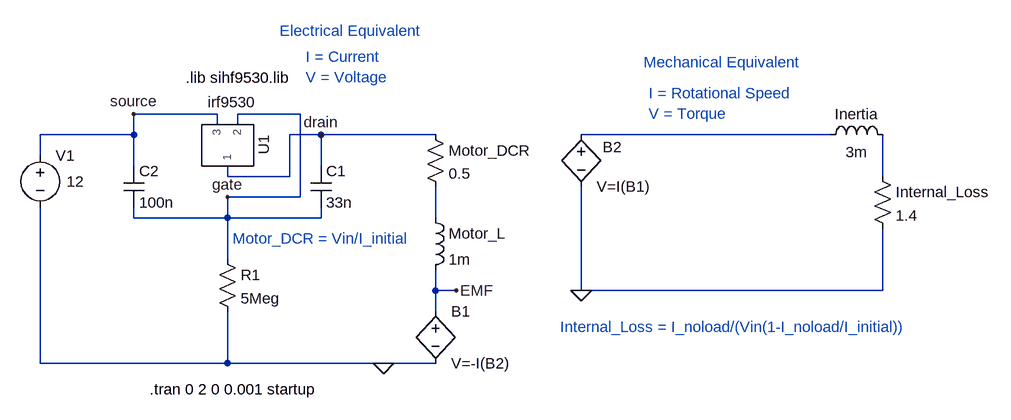
[diagram p0: schematic Motor sim YES softstart.asc]
Motor sim YES softstart.asc, the LTspice schematic file:
Version 4
SHEET 1 1992 680
WIRE -80 0 -208 0
WIRE 48 0 -48 0
WIRE -80 16 -80 0
WIRE -48 16 -48 0
WIRE -208 32 -208 0
WIRE -208 32 -352 32
WIRE 80 32 32 32
WIRE 256 32 80 32
WIRE 864 32 480 32
WIRE -352 64 -352 32
WIRE -208 80 -208 32
WIRE 80 80 80 32
WIRE -64 96 -64 80
WIRE 32 96 32 32
WIRE 32 96 -64 96
WIRE 944 96 944 32
WIRE 48 128 48 0
WIRE 48 128 -64 128
WIRE -208 160 -208 144
WIRE -64 160 -64 128
WIRE -64 160 -208 160
WIRE 80 160 80 144
WIRE 80 160 -64 160
WIRE 256 160 256 112
WIRE -64 224 -64 160
WIRE 256 272 256 240
WIRE 288 272 256 272
WIRE 480 272 480 112
WIRE 944 272 944 176
WIRE 944 272 480 272
WIRE 256 304 256 272
WIRE -352 384 -352 144
WIRE -64 384 -64 304
WIRE -64 384 -352 384
WIRE 176 384 -64 384
WIRE 256 384 176 384
FLAG 288 272 EMF
FLAG 480 272 0
FLAG 176 384 0
FLAG -64 128 gate
FLAG 80 32 drain
FLAG -208 0 source
SYMBOL voltage -352 48 R0
WINDOW 3 41 56 Left 2
WINDOW 123 0 0 Left 0
WINDOW 39 0 0 Left 0
SYMATTR Value 12
SYMATTR InstName V1
SYMBOL res 240 16 R0
SYMATTR InstName Motor_DCR
SYMATTR Value 0.5
SYMBOL res 928 80 R0
SYMATTR InstName Internal_Loss
SYMATTR Value 1.4
SYMBOL bv 256 288 R0
SYMATTR InstName B1
SYMATTR Value V=-I(B2)
SYMBOL bv 480 16 R0
WINDOW 0 33 35 Left 2
SYMATTR InstName B2
SYMATTR Value V=I(B1)
SYMBOL ind 240 144 R0
SYMATTR InstName Motor_L
SYMATTR Value 1m
SYMBOL ind 848 48 R270
WINDOW 0 32 56 VTop 2
WINDOW 3 5 56 VBottom 2
SYMATTR InstName Inertia
SYMATTR Value 3m
SYMBOL cap 64 80 R0
SYMATTR InstName C1
SYMATTR Value 33n
SYMBOL cap -224 80 R0
SYMATTR InstName C2
SYMATTR Value 100n
SYMBOL res -80 208 R0
SYMATTR InstName R1
SYMATTR Value 5Meg
SYMBOL irf9530 -64 48 M270
WINDOW 3 82 -7 VBottom 2
SYMATTR InstName U1
TEXT 16 -128 Left 2 ;Electrical Equivalent
TEXT 576 -80 Left 2 ;Mechanical Equivalent
TEXT 56 -88 Left 2 ;I = Current\nV = Voltage
TEXT 584 -32 Left 2 ;I = Rotational Speed\nV = Torque
TEXT -56 192 Left 2 ;Motor_DCR = Vin/I_initial
TEXT 448 328 Left 2 ;Internal_Loss = I_noload/(Vin(1-I_noload/I_initial))
TEXT -184 424 Left 2 !.tran 0 2 0 0.001 startup
TEXT -128 -56 Left 2 !.lib sihf9530.lib

The netlist it stands for:
* Motor sim YES softstart.asc
V1 source 0 12
R§Motor_DCR drain N003 0.5
R§Internal_Loss N002 0 1.4
B1 EMF 0 V=-I(B2)
B2 N001 0 V=I(B1)
L§Motor_L N003 EMF 1m
L§Inertia N001 N002 3m
C1 drain gate 33n
C2 source gate 100n
R1 gate 0 5Meg
XU1 drain gate source irf9530  ; pins 1 2 3
* Electrical Equivalent
* Mechanical Equivalent
* I = Current
* V = Voltage
* I = Rotational Speed
* V = Torque
* Motor_DCR = Vin/I_initial
* Internal_Loss = I_noload/(Vin(1-I_noload/I_initial))
.tran 0 2 0 0.001 startup
.lib sihf9530.lib
.lib C:\Users\User\OneDrive - UNSW\Documents\LTspice\RadiatorFanSoftStart\sihf9530.lib
.backanno
.end

* Results of the author's LTspice run, read from the files saved beside the schematic
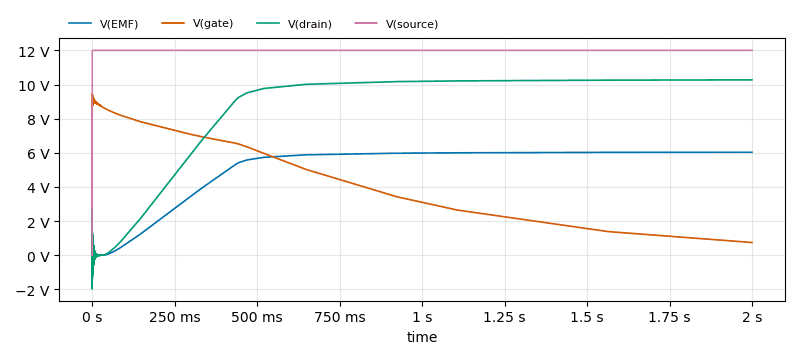
[diagram p1: Transient Analysis of Motor sim YES softstart.asc, plotted from the saved traces]
* Transient Analysis, 1 run:
*   V(EMF): min 0 V, max 6.036 V, average 5.173 V, rms 5.446 V, last 6.036 V
*   V(gate): min 0 V, max 9.472 V, average 3.793 V, rms 4.541 V, last 745.9 mV
*   V(drain): min -1.974 V, max 10.27 V, average 8.813 V, rms 9.273 V, last 10.27 V
*   V(source): min 0 V, max 12 V, average 12 V, rms 12 V, last 12 V